# EAGLE design YOTSUBA_+Y+Z_ver.1.0 (EAGLE 9.6.2)
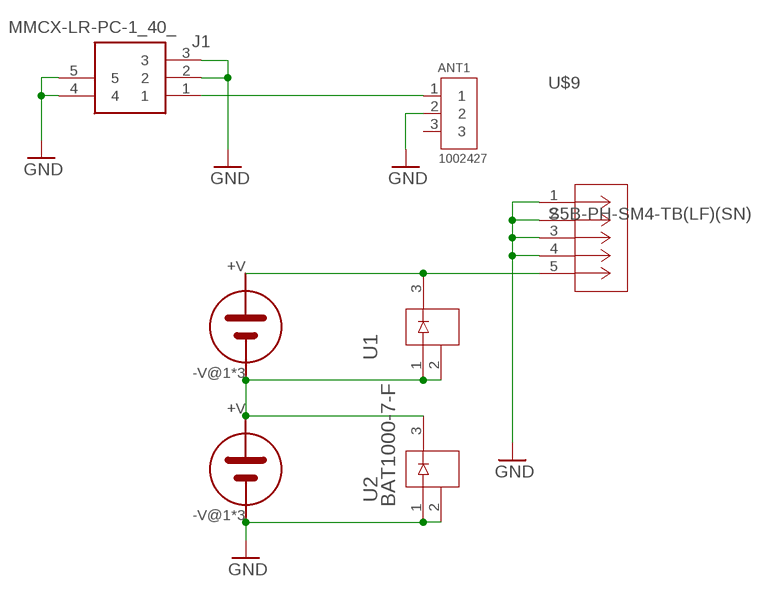
[diagram p0: schematic, sheet 1]

## Parts
ANT1  1002427  [ANTENNA_1002427]
J1  MMCX-LR-PC-1_40_  [MMCXLRPC140]
U1  BAT1000-7-F  [SOT23_BAT_DIO]
U2  BAT1000-7-F  [SOT23_BAT_DIO]
U$2  3G30A  [SOLAR_3G30A]
U$3  3G30A  [SOLAR_3G30A]
U$9  S5B-PH-SM4-TB(LF)(SN)  [CONN_S5B-PH-SM4-TB_JST]

## Nets
GND [GND]: ANT1.2 J1.2 J1.3 J1.4 J1.5 U2.1 U2.2 U$3.-V@1(-V) U$3.-V@2(-V) U$3.-V@3(-V) U$9.1 U$9.2 U$9.3 U$9.4
N$5: U1.1 U1.2 U2.3 U$2.-V@1(-V) U$2.-V@2(-V) U$2.-V@3(-V) U$3.+V
N$6: U1.3 U$2.+V U$9.5
RF2 [ANTENNA]: ANT1.1 J1.1
Unconnected: ANT1.3

## Library data of the parts
ANT1 = 1002427:1002427: RF ANT 868MHZ/915MHZ STAMPED MET; DESCRIPTION: 868MHz, 915MHz, 1.575GHz Beidou, GLONASS, GPS, ISM, LoRa, LPWAN, Sigfox Stamped Metal RF Antenna 868MHz, 915MHz, 1.561GHz ~ 1.602GHz 3dBi Solder Surface Mount; DIGI-KEY_PART_NUMBER: 478-1002427TR-ND; MF: Ethertronics/AVX; MP: 1002427; PACKAGE: None; PURCHASE-URL: https://pricing.snapeda.com/search/part/1002427/?ref=eda
J1 = MMCX-LR-PC-1_40_:MMCX-LR-PC-1_40_: RF Connectors / Coaxial Connectors MINI PUSH-ON CONN RECEPT RA Source: Datasheet <https://componentsearchengine.com/Datasheets/1/MMCX-LR-PC-1(40).pdf>; DESCRIPTION: RF Connectors / Coaxial Connectors MINI PUSH-ON CONN RECEPT RA; HEIGHT: 3.95mm; MANUFACTURER_NAME: Hirose; MANUFACTURER_PART_NUMBER: MMCX-LR-PC-1(40); MOUSER_PART_NUMBER: 798-MMCX-LR-PC-1(40); MOUSER_PRICE-STOCK: https://www.mouser.co.uk/ProductDetail/Hirose-Connector/MMCX-LR-PC-140?qs=XQjbzJWzFPVvtPijmLd%2FXQ%3D%3D
U1 U2 = BAT1000:BAT1000-7-F; COPYRIGHT: Copyright (C) 2023 Ultra Librarian. All rights reserved.; DIGIKEY_PART_NUMBER_1: BAT1000-7FDITR-ND; DIGIKEY_PART_NUMBER_2: BAT1000-7FDICT-ND; DIGIKEY_PART_NUMBER_3: BAT1000-7FDIDKR-ND; MANUFACTURER_PART_NUMBER: BAT1000-7-F; MFR_NAME: Diodes Inc
U$2 U$3 = 3G30A_normal:3G30A
U$9 = S5B-PH-SM4:S5B-PH-SM4-TB(LF)(SN); COPYRIGHT: Copyright (C) 2023 Ultra Librarian. All rights reserved.; DIGIKEY_PART_NUMBER_1: 455-1752-2-ND; DIGIKEY_PART_NUMBER_2: 455-1752-1-ND; DIGIKEY_PART_NUMBER_3: 455-1752-6-ND; MANUFACTURER_PART_NUMBER: S5B-PH-SM4-TB(LF)(SN); MFR_NAME: JST

## Net classes
2 GND: clearance 0.5 mm to class 0, clearance 0.21 mm to class 1, clearance 0.5 mm

## Board
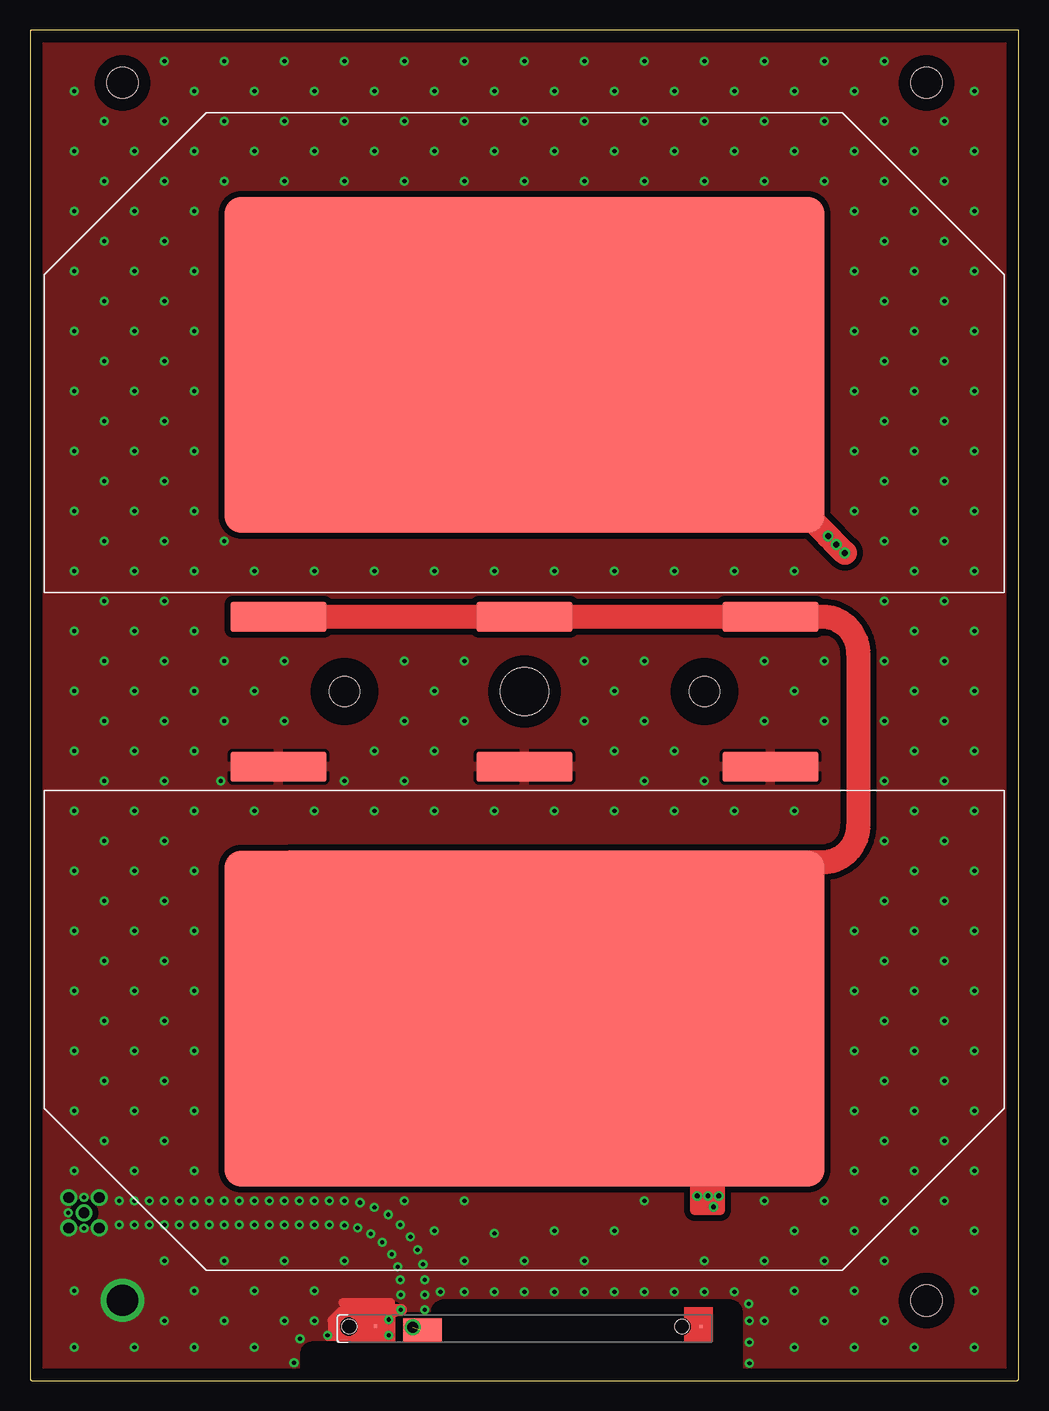
[diagram p1: board, top side]
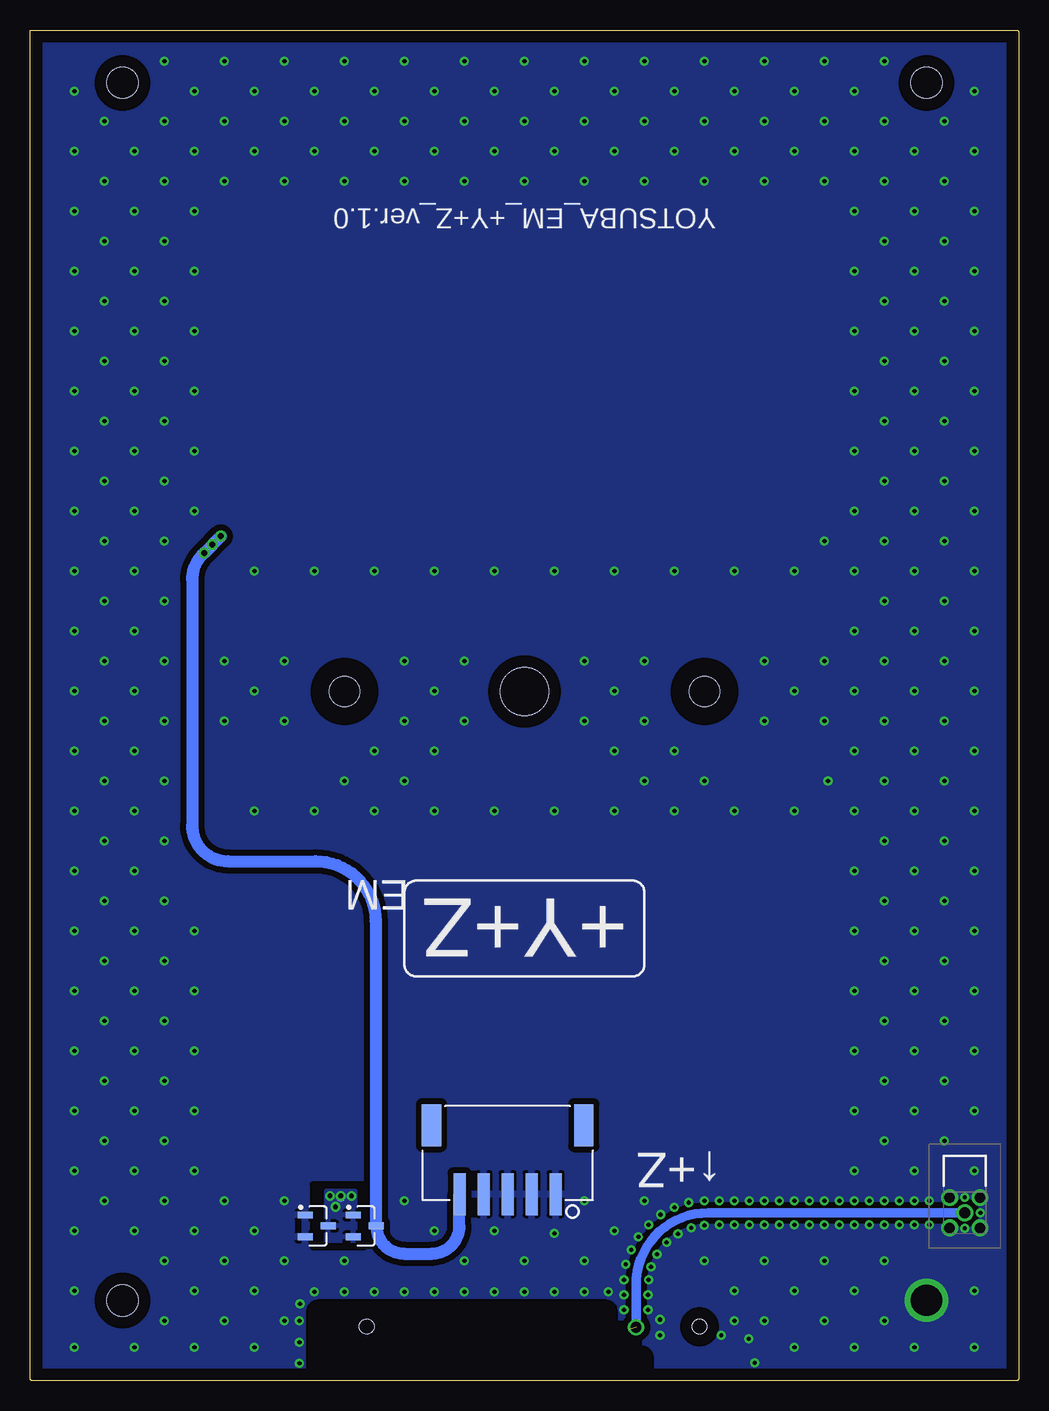
[diagram p2: board, bottom side, seen from below]

Size 82.4 x 112.6 mm. Coordinates in mm from the lower left corner, seen from the top.
Outline: 82.4,112.6 0.2,112.6 arc90 0,112.4 0,0.2 arc90 0.2,0 82.2,0 arc90 82.4,0.2 82.4,112.6
Copper layers (1*16): Top 0.035mm / dielectric 1.2mm / Bottom 0.035mm
Design rules "default *": minimum track width 6mil, minimum drill 0.35mm, track to track 6mil, track to pad 6mil, pad to pad 6mil, via to via 6mil, smd to smd 6mil, copper to edge 40mil, drill to drill 6mil, minimum pad ring 10mil, minimum via ring 8mil, stop-mask expansion 4mil, vias tented up to drill 30mil, thermal gap 10mil
Holes 2.6 mm at 74.7,6.7 7.7,108.2 74.7,108.2
Holes 4 mm at 41.2,57.45
Holes 2.5 mm at 26.2,57.45 56.2,57.45
tRestrict: area 23.5,54.8 to 28.9,60.2; area 53.5,54.8 to 58.9,60.2; 9 lines
bRestrict: area 23.5,54.8 to 28.9,60.2; area 53.5,54.8 to 58.9,60.2; 15 lines

### Footprints (pad centres in the part's own frame; a part is rotated, then mirrored left to right if it is on the bottom)
ANTENNA_1002427 = smd 3.2 x 1.9: 1 24.1,-1.05 | smd 0.3 x 0.3: 2 28.02,-1.375; 3 0.875,-1.325 | hole 1.2: 2.46,-1.3; 30.2,-1.3
MMCXLRPC140 = drill 0.9 pad 1.4: 1 0,0; 2 -1.27,-1.27; 3 1.27,-1.27; 4 1.27,1.27; 5 -1.27,1.27
SOT23_BAT_DIO = smd 0.568 x 1.259: 1 -0.915,-0.965; 2 0.915,-0.965; 3 0,0.965
SOLAR_3G30A = smd 50 x 28: +V 0,19 | smd 8 x 2.5: -V@1 -20.5,-2; -V@2 20.5,-2; -V@3 0,-2
CONN_S5B-PH-SM4-TB_JST = smd 0.991 x 3.505: 1 4,-3.453; 2 2,-3.453; 3 0,-3.453; 4 -2,-3.453; 5 -4,-3.453 | smd 1.6 x 3.505: 6 -6.35,2.297; 7 6.35,2.297

### Placement (x,y rotation side)
ANT1  56.8,3.2 180 top
J1  4.5,14 90 bottom
U1  54.5,12.9 270 bottom
U2  58.5,12.9 270 bottom
U$2  41.2,65.7 0 top
U$3  41.2,49.2 180 top
U$9  42.6,19 0 bottom

### Tracks (layer width: path | path; a pad name or v marks a point on that pad's centre or on a via)
GND  (via drill 0.35, 2.6)
  Top 0.2: ANT1.2 29.24,3.5
  Top 0.4: 29.24,3.5 24.8,3.5 | 25.3,3.8 25.9,3.8
  Top 0.8: ANT1.2 30,4.58 30,6.5 26.8,6.5 | 26.8,6.5 26.1,6.5 | 26.8,6.5 26.8,5.7 26,5.7
  Top 1: 25.3,5 25.3,3.8 | v29.9,5.1 arc-90 30.7,5.9 v30.9,5.9
  Top 1.016: 26,5.7 25.3,5
  other vias: 34.2,7.4 43.7,47.5 33.7,47.5 31.2,50 26.2,50 28.7,47.5 23.7,47.5 18.7,47.5 15.9,50 38.7,47.5 51.2,50 48.7,47.5 56.2,50 58.7,47.5 63.7,47.5 71.2,45 73.7,47.5 71.2,50 73.7,52.5 78.7,52.5 76.2,50 78.7,47.5 76.2,45 78.7,42.5 73.7,42.5 71.2,40 68.7,37.5 73.7,37.5 76.2,40 78.7,37.5 76.2,35 71.2,35 73.7,32.5 78.7,32.5 76.2,30 71.2,30 68.7,32.5 68.7,27.5 73.7,27.5 78.7,27.5 76.2,25 71.2,25 68.7,22.5 73.7,22.5 78.7,22.5 76.2,20 71.2,20 68.7,17.5 73.7,17.5 78.7,17.5 71.2,15 66.2,15 76.2,15 78.7,12.5 78.7,7.5 73.7,12.5 68.7,12.5 63.7,12.5 61.2,15 61.2,10 66.2,10 71.2,10 68.7,7.5 63.7,7.5 61.2,5 63.7,2.8 66.2,5 71.2,5 68.7,2.8 73.7,2.8 78.7,2.8 56.2,10 46.2,10 41.2,10 38.7,12.3 36.2,10 33.7,12.5 36.2,15 31.2,15 26.2,15 23.7,13 21.2,15 16.2,15 21.2,10 16.2,10 48.7,12.5 51.2,15 13.7,17.5 8.7,17.5 11.2,20 6.2,20 8.7,22.5 13.7,22.5 11.2,25 6.2,25 3.7,22.5 8.7,27.5 13.7,27.5 11.2,30 6.2,30 3.7,27.5 3.7,32.5 8.7,32.5 13.7,32.5 11.2,35 6.2,35 8.7,37.5 13.7,37.5 11.2,40 6.2,40 3.7,37.5 3.7,42.5 8.7,42.5 6.2,45 3.7,47.5 8.7,47.5 11.2,45 6.2,50 11.2,50 8.7,52.5 3.7,52.5 18.7,2.8 13.7,2.8 8.7,2.8 11.2,5 3.7,2.8 3.7,7.5 29.9,3.8 11.2,15 7.7,6.7 3.7,17.5 13.7,15 12.45,15 14.95,15 9.95,15 8.7,15 7.45,15 17.45,15 18.7,15 19.95,15 22.45,15 23.7,15 24.95,15 24.95,13 26.2,12.95 22.45,13 21.2,13 19.95,13 18.7,13 17.45,13 16.2,13 14.95,13 13.7,13 12.45,13 11.2,13 9.95,13 8.7,13 7.45,13 4.5,15.3 3.2,14 4.5,12.7 16.2,5 21.2,5 18.7,7.5 13.7,7.5 11.2,10 23.7,7.5 26.2,10 36.2,7.4 41.2,7.4 46.2,7.4 51.2,7.4 56.2,7.4 59.95,1.45 23.7,5 22,1.5 38.7,7.4 43.7,7.4 48.7,7.4 53.7,7.4 58.7,7.4 59.95,5 59.95,3.2 24.8,3.8 6.2,55 3.7,57.5 8.7,57.5 11.2,55 6.2,60 11.2,60 13.7,57.5 16.2,55 13.7,52.5 18.7,57.5 21.2,55 21.2,60 16.2,60 31.2,55 28.7,52.5 33.7,52.5 36.2,55 33.7,57.5 31.2,60 36.2,60 46.2,55 46.2,60 48.7,57.5 51.2,60 51.2,55 48.7,52.5 53.7,52.5 53.7,47.5 61.2,55 63.7,57.5 61.2,60 66.2,60 66.2,55 76.2,55 73.7,57.5 73.7,62.5 76.2,60 78.7,57.5 78.7,62.5 71.2,60 71.2,55 71.2,70 71.2,65 76.2,65 78.7,67.5 73.7,67.5 76.2,70 73.7,72.5 68.7,72.5 71.2,75 68.7,77.5 71.2,80 68.7,82.5 73.7,82.5 73.7,77.5 76.2,80 76.2,75 78.7,72.5 78.7,77.5 78.7,82.5 76.2,85 71.2,85 68.7,87.5 73.7,87.5 78.7,87.5 76.2,90 71.2,90 68.7,92.5 68.7,97.5 71.2,95 73.7,92.5 76.2,95 73.7,97.5 78.7,97.5 78.7,92.5 8.7,62.5 11.2,65 13.7,62.5 13.7,67.5 8.7,67.5 6.2,65 3.7,62.5 3.7,67.5 6.2,70 3.7,72.5 6.2,75 11.2,70 16.2,70 18.7,67.5 23.7,67.5 28.7,67.5 38.7,67.5 33.7,67.5 3.7,77.5 8.7,77.5 8.7,72.5 11.2,75 13.7,72.5 13.7,77.5 13.7,82.5 11.2,80 8.7,82.5 6.2,80 3.7,82.5 3.7,87.5 6.2,85 8.7,87.5 11.2,85 13.7,87.5 11.2,90 6.2,90 3.7,92.5 8.7,92.5 6.2,95 11.2,95 13.7,92.5 13.7,97.5 8.7,97.5 3.7,97.5 6.2,100 3.7,102.5 3.7,107.5 6.2,105 8.7,102.5 11.2,100 13.7,102.5 11.2,105 11.2,110 13.7,107.5 16.2,105 18.7,102.5 21.2,105 18.7,107.5 16.2,110 16.2,100 21.2,100 23.7,102.5 26.2,100 28.7,102.5 31.2,100 33.7,102.5 31.2,105 26.2,105 23.7,107.5 21.2,110 26.2,110 28.7,107.5 31.2,110 33.7,107.5 36.2,105 41.2,110 36.2,110 36.2,100 43.7,67.5 48.7,67.5 53.7,67.5 58.7,67.5 63.7,67.5 38.7,107.5 41.2,105 41.2,100 38.7,102.5 43.7,102.5 43.7,107.5 46.2,110 48.7,107.5 46.2,105 48.7,102.5 46.2,100 51.2,100 51.2,105 53.7,102.5 56.2,105 58.7,102.5 56.2,100 61.2,100 63.7,102.5 61.2,105 58.7,107.5 53.7,107.5 51.2,110 56.2,110 61.2,110 63.7,107.5 66.2,110 71.2,110 68.7,107.5 66.2,105 71.2,105 68.7,102.5 66.2,100 71.2,100 73.7,102.5 76.2,100 78.7,102.5 76.2,105 78.7,107.5 13.7,47.5 13.7,42.5 43.7,12.5 32.9,5.9 32.9,8.4 32.9,7.15 30.9,7.15 30.85,8.4 30.65,9.5 30.15,10.55 29.35,11.55 28.4,12.25 27.3,12.75 27.5,14.85 28.7,14.45 29.85,13.85 30.85,13 31.7,12 32.3,10.9 32.75,9.7 22.5,3.5 59.9,6.4
  pour Top: -4.45,103.9 arc90 -4.7,103.65 -4.7,-4.85 arc90 -4.15,-5.4 88.8,-5.4 88.8,103.65 arc90 77.55,114.9 -1.45,114.9 -4.45,111.9
  pour Bottom: 89.5,119.7 -8.4,119.7 -8.4,-8.8 89.5,-8.8
N$5  (via drill 0.4)
  Top 0.8: U$3.+V 57.5,30.2 57.5,14.2 55.4,14.2 55.4,15.7 | 55.4,15.7 55.4,16.3 57.1,16.3 57.1,15.7 v57.4,15.4 57.1,15.1 | 56.5,15.3 55.9,15.3 55.9,14.4 56.5,14.4 56.5,14.5 | v56.5,15.4 56.5,14.5 | v56.5,15.4 56.5,15.7 55.4,15.7 | v56.5,15.4 56.8,15.1 57.1,15.1 | 57.1,15.1 57.1,14.7 v56.95,14.5 56.5,14.5
  Top 2: U$3.+V 21.5,30.2 21.5,43.2 66,43.2 arc90 69,46.2 69,60.7 arc90 66,63.7 U$2.-V@2 | U$2.-V@1 U$2.-V@3 U$2.-V@2 | 61.7,63.8 U$2.-V@2
  Bottom 0.8: v56.5,15.4 56.5,15.3
  other vias: 55.6,15.4
  pour Bottom: 55.3,15.8 57.7,15.8 57.7,11.7 55.3,11.7
N$6  (via drill 0.5)
  Top 2: U$2.+V 41.29,82.78 | 41.29,82.78 41.49,78.5 47.65,72.2 64,72.2 | 41.29,82.78 42.41,83.9 43.3,83.9 52.3,74.9 62,74.9 v66.5,70.4 v67.2,69.7 v67.9,69
  Bottom 1: U$9.5 46.61,15.54 46.61,12.9 arc90 48.91,10.6 51.23,10.6 arc90 U1.3 53.6,12.9 53.6,38.3 arc-90 58.6,43.3 65.9,43.3 arc90 68.9,46.3 68.9,66.76 arc45 68.02,68.88 v67.9,69 v66.5,70.4
RF2  (via drill 0.9)  (1 unrouted)
  Top 0.8: v31.9,4.45 31.5,4.45 | ANT1.1 32.5,4.25
  Bottom 0.8: J1.1 25.9,14 arc-90 31.9,8 v31.9,4.45
(copper drawn outside any net)
  shapes: Top circle x1

### Text on the board
bNames: YOTSUBA_EM_+Y+Z_ver.1.0 | EM | +Y+Z | ↑+Z